# Altium schematic sheet Adapters.SchDoc: various
size 420 x 297 mm; Author: G.Kasprowicz; CompanyName: WUT ISE; DrawnBy: G.Kasprowicz; Organization: WUT ISE; Address1: PW ISE; Address2: Nowowiejska 15/19 00-665 Warsaw; Address3: gkasprow@gmail.com; DocumentNumber: 5; Revision: 2; SheetNumber: 5; SheetTotal: 5; ModifiedBy: -; CheckedDate: -; Title2: adapters; DivGrp: WUT ISE; Designer: G.Kasprowicz; ModifiedDate: -; ProjectName: Sensor Box
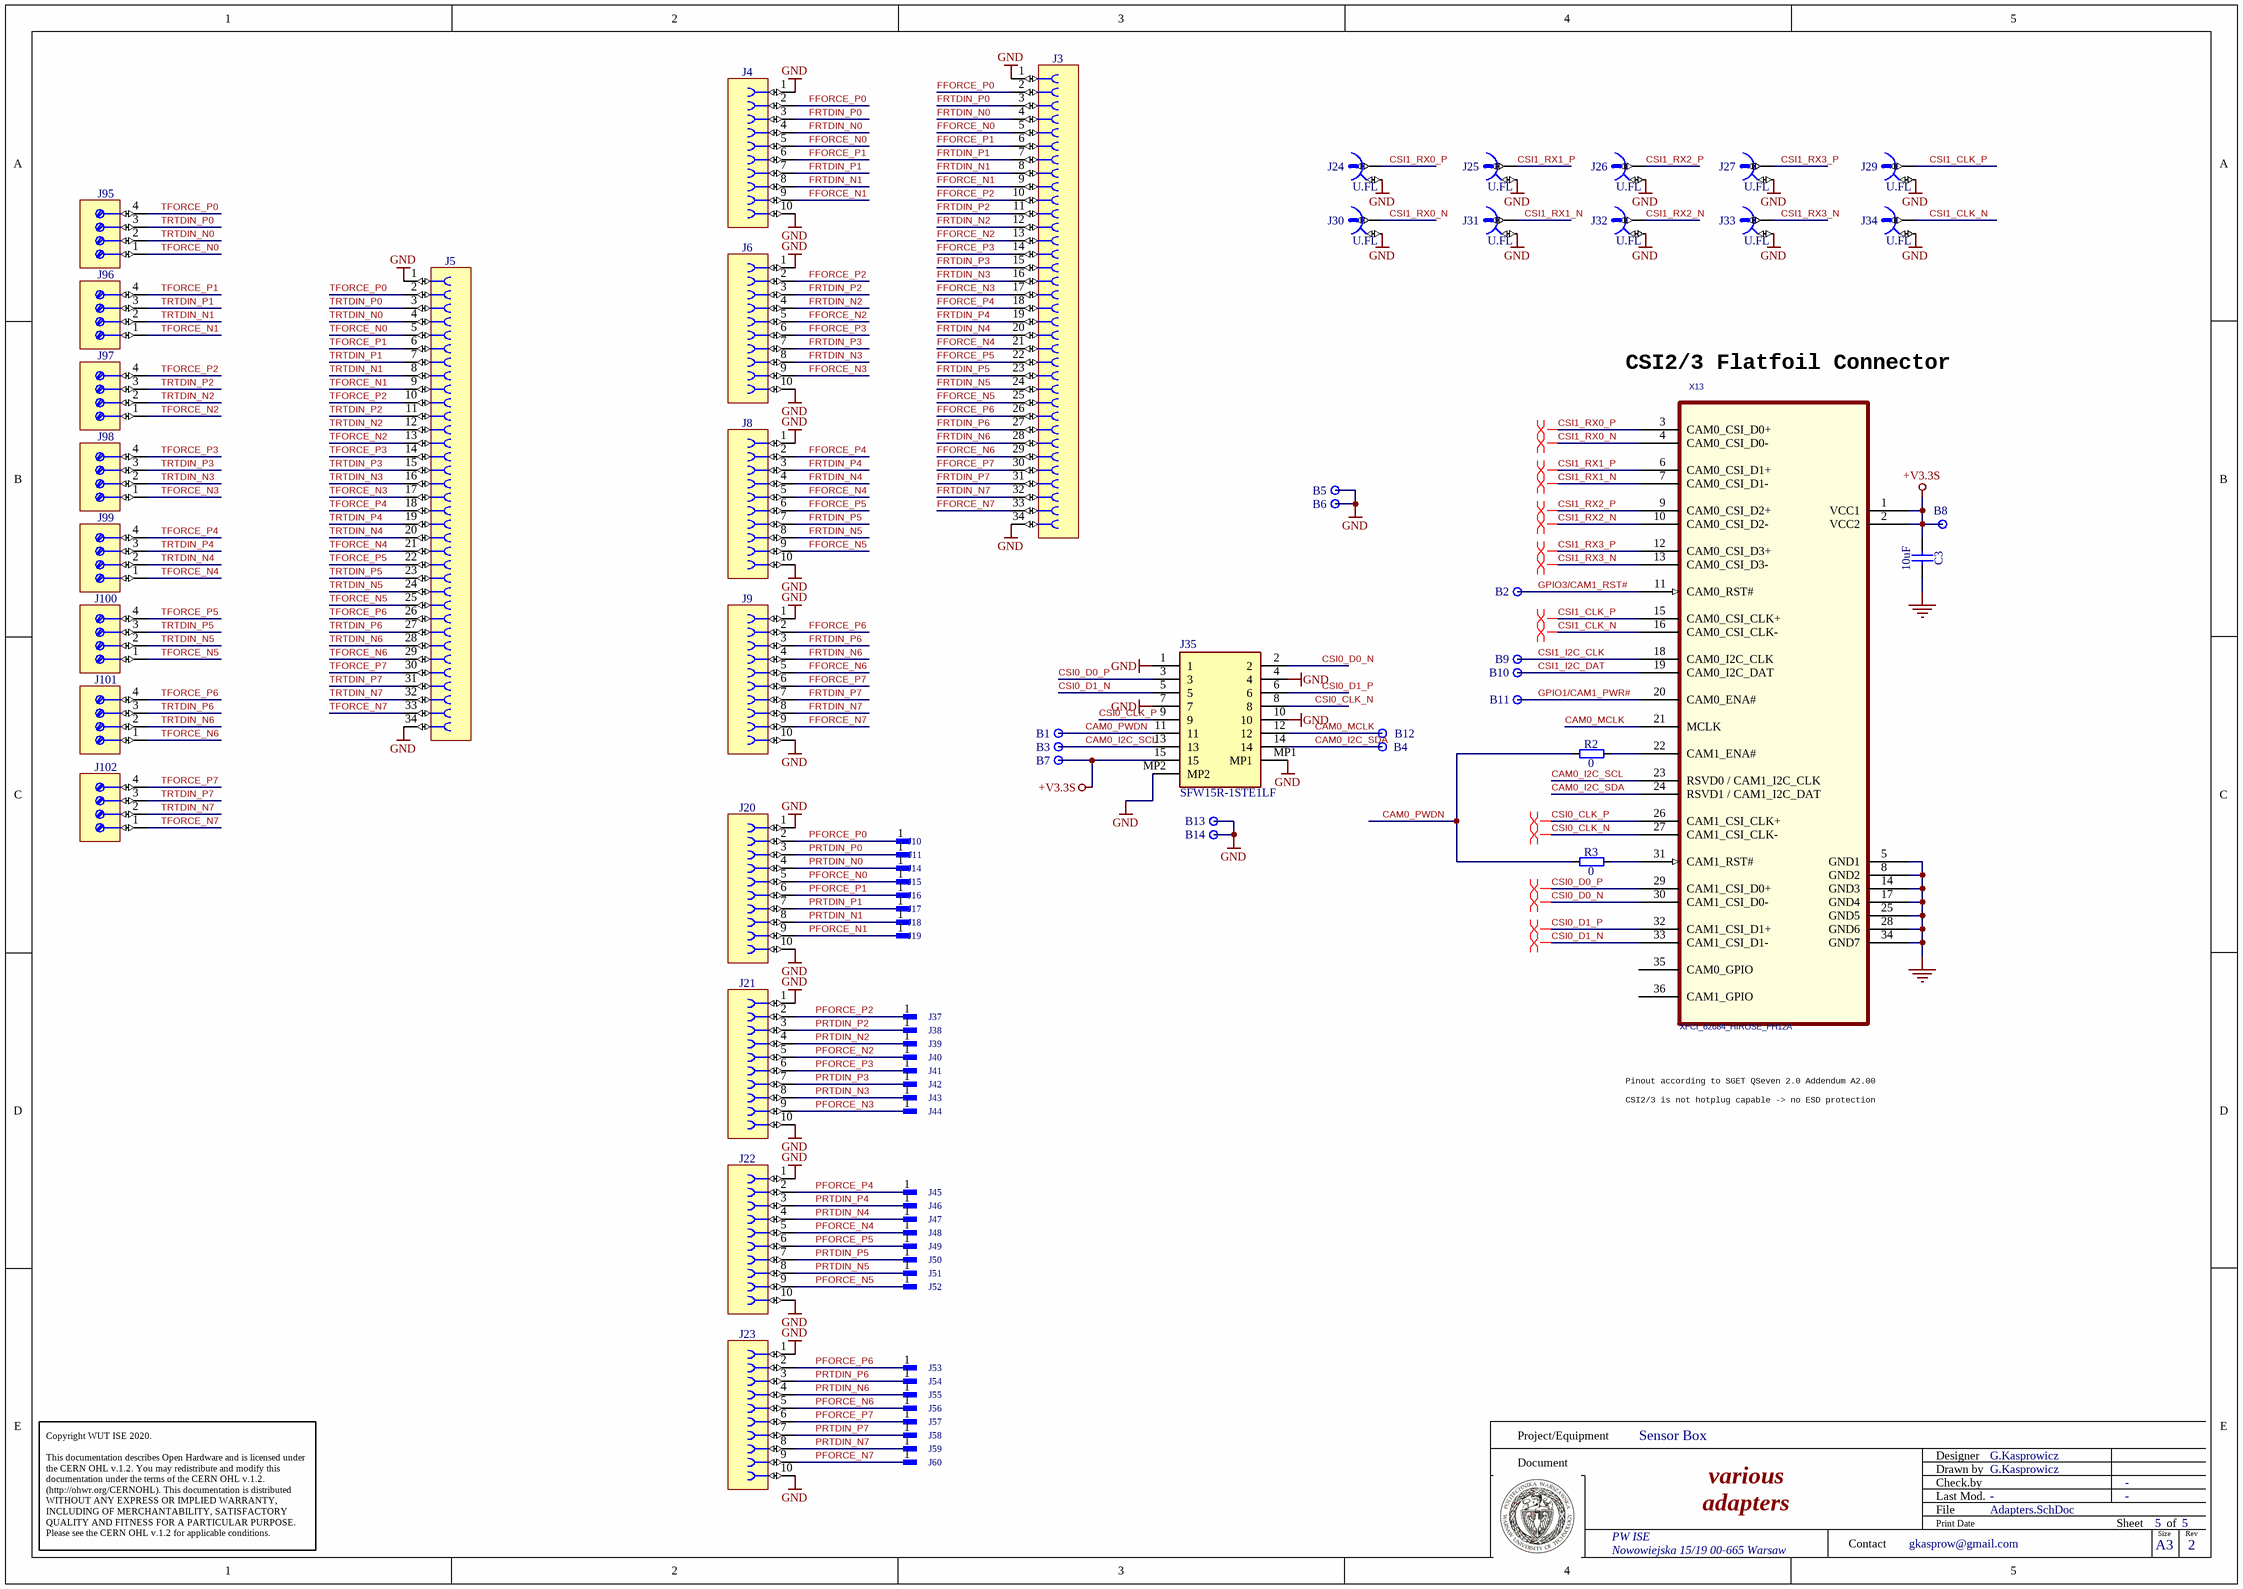
[diagram p0: Adapters.SchDoc]

## Parts
B1  Plated Hole  [c130h80]  (value not drawn)  (no BOM)
B2  Plated Hole  [c130h80]  (value not drawn)  (no BOM)
B3  Plated Hole  [c130h80]  (value not drawn)  (no BOM)
B4  Plated Hole  [c130h80]  (value not drawn)  (no BOM)
B5  Plated Hole  [c130h80]  (value not drawn)  (no BOM)
B6  Plated Hole  [c130h80]  (value not drawn)  (no BOM)
B7  Plated Hole  [c130h80]  (value not drawn)  (no BOM)
B8  Plated Hole  [c130h80]  (value not drawn)  (no BOM)
B9  Plated Hole  [c130h80]  (value not drawn)  (no BOM)
B10  Plated Hole  [c130h80]  (value not drawn)  (no BOM)
B11  Plated Hole  [c130h80]  (value not drawn)  (no BOM)
B12  Plated Hole  [c130h80]  (value not drawn)  (no BOM)
B13  Plated Hole  [c130h80]  (value not drawn)  (no BOM)
B14  Plated Hole  [c130h80]  (value not drawn)  (no BOM)
C3  10uF  [CAPC2012X135N]
J3  Socket 34  [3M_9134-4500PL]  (value not drawn)
J4  FFC/FPC  [MOLEX_52745-1097]  (value not drawn)
J5  Socket 34  [3M_9134-4500PL]  (value not drawn)
J6  FFC/FPC  [MOLEX_52745-1097]  (value not drawn)
J8  FFC/FPC  [MOLEX_52745-1097]  (value not drawn)
J9  FFC/FPC  [MOLEX_52745-1097]  (value not drawn)
J10  SMD Pad  [R350X200]  (value not drawn)
J11  SMD Pad  [R350X200]  (value not drawn)
J14  SMD Pad  [R350X200]  (value not drawn)
J15  SMD Pad  [R350X200]  (value not drawn)
J16  SMD Pad  [R350X200]  (value not drawn)
J17  SMD Pad  [R350X200]  (value not drawn)
J18  SMD Pad  [R350X200]  (value not drawn)
J19  SMD Pad  [R350X200]  (value not drawn)
J20  FFC/FPC  [MOLEX_52745-1097]  (value not drawn)
J21  FFC/FPC  [MOLEX_52745-1097]  (value not drawn)
J22  FFC/FPC  [MOLEX_52745-1097]  (value not drawn)
J23  FFC/FPC  [MOLEX_52745-1097]  (value not drawn)
J24  U.FL  [HIROSE_U.FL-R-SMT-1(10)]
J25  U.FL  [HIROSE_U.FL-R-SMT-1(10)]
J26  U.FL  [HIROSE_U.FL-R-SMT-1(10)]
J27  U.FL  [HIROSE_U.FL-R-SMT-1(10)]
J29  U.FL  [HIROSE_U.FL-R-SMT-1(10)]
J30  U.FL  [HIROSE_U.FL-R-SMT-1(10)]
J31  U.FL  [HIROSE_U.FL-R-SMT-1(10)]
J32  U.FL  [HIROSE_U.FL-R-SMT-1(10)]
J33  U.FL  [HIROSE_U.FL-R-SMT-1(10)]
J34  U.FL  [HIROSE_U.FL-R-SMT-1(10)]
J35  SFW15R-1STE1LF  [SFW15R1STE1LF]
J37  SMD Pad  [R350X200]  (value not drawn)
J38  SMD Pad  [R350X200]  (value not drawn)
J39  SMD Pad  [R350X200]  (value not drawn)
J40  SMD Pad  [R350X200]  (value not drawn)
J41  SMD Pad  [R350X200]  (value not drawn)
J42  SMD Pad  [R350X200]  (value not drawn)
J43  SMD Pad  [R350X200]  (value not drawn)
J44  SMD Pad  [R350X200]  (value not drawn)
J45  SMD Pad  [R350X200]  (value not drawn)
J46  SMD Pad  [R350X200]  (value not drawn)
J47  SMD Pad  [R350X200]  (value not drawn)
J48  SMD Pad  [R350X200]  (value not drawn)
J49  SMD Pad  [R350X200]  (value not drawn)
J50  SMD Pad  [R350X200]  (value not drawn)
J51  SMD Pad  [R350X200]  (value not drawn)
J52  SMD Pad  [R350X200]  (value not drawn)
J53  SMD Pad  [R350X200]  (value not drawn)
J54  SMD Pad  [R350X200]  (value not drawn)
J55  SMD Pad  [R350X200]  (value not drawn)
J56  SMD Pad  [R350X200]  (value not drawn)
J57  SMD Pad  [R350X200]  (value not drawn)
J58  SMD Pad  [R350X200]  (value not drawn)
J59  SMD Pad  [R350X200]  (value not drawn)
J60  SMD Pad  [R350X200]  (value not drawn)
J95  (no value)  [PHOENIX_1725672]
J96  (no value)  [PHOENIX_1725672]
J97  (no value)  [PHOENIX_1725672]
J98  (no value)  [PHOENIX_1725672]
J99  (no value)  [PHOENIX_1725672]
J100  (no value)  [PHOENIX_1725672]
J101  (no value)  [PHOENIX_1725672]
J102  (no value)  [PHOENIX_1725672]
R2  0  [RESC1005X40N]
R3  0  [RESC1005X40N]
X13  XFCI_62684_HIROSE_FH12A  [TYCO_3-1734592-6]

## Nets
+V3.3S: B7.1 B8.1 C3.1 J35.15 X13.1(VCC1) X13.2(VCC2)
GND: B5.1 B6.1 B13.1 B14.1 C3.2 J3.1 J3.34 J4.1 J4.10 J5.1 J5.34 J6.1 J6.10 J8.1 J8.10 J9.1 J9.10 J20.1 J20.10 J21.1 J21.10 J22.1 J22.10 J23.1 J23.10 J24.2 J25.2 J26.2 J27.2 J29.2 J30.2 J31.2 J32.2 J33.2 J34.2 J35.1 J35.4 J35.7 J35.10 J35.MP1 J35.MP2 X13.5(GND1) X13.8(GND2) X13.14(GND3) X13.17(GND4) X13.25(GND5) X13.28(GND6) X13.34(GND7)
CAM0_I2C_SCL: B3.1 J35.13 X13.23(RSVD0_/_CAM1_I2C_CLK)
CAM0_I2C_SDA: B4.1 J35.14 X13.24(RSVD1_/_CAM1_I2C_DAT)
CAM0_MCLK: B12.1 J35.12 X13.21(MCLK)
CAM0_PWDN: B1.1 J35.11 R2.1 R3.1
CSI0_CLK_N: J35.8 X13.27(CAM1_CSI_CLK-)
CSI0_CLK_P: J35.9 X13.26(CAM1_CSI_CLK+)
CSI0_D0_N: J35.2 X13.30(CAM1_CSI_D0-)
CSI0_D0_P: J35.3 X13.29(CAM1_CSI_D0+)
CSI0_D1_N: J35.5 X13.33(CAM1_CSI_D1-)
CSI0_D1_P: J35.6 X13.32(CAM1_CSI_D1+)
CSI1_CLK_N: J34.1 X13.16(CAM0_CSI_CLK-)
CSI1_CLK_P: J29.1 X13.15(CAM0_CSI_CLK+)
CSI1_I2C_CLK: B9.1 X13.18(CAM0_I2C_CLK)
CSI1_I2C_DAT: B10.1 X13.19(CAM0_I2C_DAT)
CSI1_RX0_N: J30.1 X13.4(CAM0_CSI_D0-)
CSI1_RX0_P: J24.1 X13.3(CAM0_CSI_D0+)
CSI1_RX1_N: J31.1 X13.7(CAM0_CSI_D1-)
CSI1_RX1_P: J25.1 X13.6(CAM0_CSI_D1+)
CSI1_RX2_N: J32.1 X13.10(CAM0_CSI_D2-)
CSI1_RX2_P: J26.1 X13.9(CAM0_CSI_D2+)
CSI1_RX3_N: J33.1 X13.13(CAM0_CSI_D3-)
CSI1_RX3_P: J27.1 X13.12(CAM0_CSI_D3+)
FFORCE_N0: J3.5 J4.5
FFORCE_N1: J3.9 J4.9
FFORCE_N2: J3.13 J6.5
FFORCE_N3: J3.17 J6.9
FFORCE_N4: J3.21 J8.5
FFORCE_N5: J3.25 J8.9
FFORCE_N6: J3.29 J9.5
FFORCE_N7: J3.33 J9.9
FFORCE_P0: J3.2 J4.2
FFORCE_P1: J3.6 J4.6
FFORCE_P2: J3.10 J6.2
FFORCE_P3: J3.14 J6.6
FFORCE_P4: J3.18 J8.2
FFORCE_P5: J3.22 J8.6
FFORCE_P6: J3.26 J9.2
FFORCE_P7: J3.30 J9.6
FRTDIN_N0: J3.4 J4.4
FRTDIN_N1: J3.8 J4.8
FRTDIN_N2: J3.12 J6.4
FRTDIN_N3: J3.16 J6.8
FRTDIN_N4: J3.20 J8.4
FRTDIN_N5: J3.24 J8.8
FRTDIN_N6: J3.28 J9.4
FRTDIN_N7: J3.32 J9.8
FRTDIN_P0: J3.3 J4.3
FRTDIN_P1: J3.7 J4.7
FRTDIN_P2: J3.11 J6.3
FRTDIN_P3: J3.15 J6.7
FRTDIN_P4: J3.19 J8.3
FRTDIN_P5: J3.23 J8.7
FRTDIN_P6: J3.27 J9.3
FRTDIN_P7: J3.31 J9.7
GPIO1/CAM1_PWR#: B11.1 X13.20(CAM0_ENA#)
GPIO3/CAM1_RST#: B2.1 X13.11(CAM0_RST#)
PFORCE_N0: J15.1 J20.5
PFORCE_N1: J19.1 J20.9
PFORCE_N2: J21.5 J40.1
PFORCE_N3: J21.9 J44.1
PFORCE_N4: J22.5 J48.1
PFORCE_N5: J22.9 J52.1
PFORCE_N6: J23.5 J56.1
PFORCE_N7: J23.9 J60.1
PFORCE_P0: J10.1 J20.2
PFORCE_P1: J16.1 J20.6
PFORCE_P2: J21.2 J37.1
PFORCE_P3: J21.6 J41.1
PFORCE_P4: J22.2 J45.1
PFORCE_P5: J22.6 J49.1
PFORCE_P6: J23.2 J53.1
PFORCE_P7: J23.6 J57.1
PRTDIN_N0: J14.1 J20.4
PRTDIN_N1: J18.1 J20.8
PRTDIN_N2: J21.4 J39.1
PRTDIN_N3: J21.8 J43.1
PRTDIN_N4: J22.4 J47.1
PRTDIN_N5: J22.8 J51.1
PRTDIN_N6: J23.4 J55.1
PRTDIN_N7: J23.8 J59.1
PRTDIN_P0: J11.1 J20.3
PRTDIN_P1: J17.1 J20.7
PRTDIN_P2: J21.3 J38.1
PRTDIN_P3: J21.7 J42.1
PRTDIN_P4: J22.3 J46.1
PRTDIN_P5: J22.7 J50.1
PRTDIN_P6: J23.3 J54.1
PRTDIN_P7: J23.7 J58.1
TFORCE_N0: J5.5 J95.1
TFORCE_N1: J5.9 J96.1
TFORCE_N2: J5.13 J97.1
TFORCE_N3: J5.17 J98.1
TFORCE_N4: J5.21 J99.1
TFORCE_N5: J5.25 J100.1
TFORCE_N6: J5.29 J101.1
TFORCE_N7: J5.33 J102.1
TFORCE_P0: J5.2 J95.4
TFORCE_P1: J5.6 J96.4
TFORCE_P2: J5.10 J97.4
TFORCE_P3: J5.14 J98.4
TFORCE_P4: J5.18 J99.4
TFORCE_P5: J5.22 J100.4
TFORCE_P6: J5.26 J101.4
TFORCE_P7: J5.30 J102.4
TRTDIN_N0: J5.4 J95.2
TRTDIN_N1: J5.8 J96.2
TRTDIN_N2: J5.12 J97.2
TRTDIN_N3: J5.16 J98.2
TRTDIN_N4: J5.20 J99.2
TRTDIN_N5: J5.24 J100.2
TRTDIN_N6: J5.28 J101.2
TRTDIN_N7: J5.32 J102.2
TRTDIN_P0: J5.3 J95.3
TRTDIN_P1: J5.7 J96.3
TRTDIN_P2: J5.11 J97.3
TRTDIN_P3: J5.15 J98.3
TRTDIN_P4: J5.19 J99.3
TRTDIN_P5: J5.23 J100.3
TRTDIN_P6: J5.27 J101.3
TRTDIN_P7: J5.31 J102.3
NetR2_2: R2.2 X13.22(CAM1_ENA#)
NetR3_2: R3.2 X13.31(CAM1_RST#)

Not connected (* = marked no-connect by the designer): X13 35(CAM0_GPIO) 36(CAM1_GPIO)

## Layout directives
differential pair: CSI0_CLK_N, CSI0_CLK_P, CSI0_D0_N, CSI0_D0_P, CSI0_D1_N, CSI0_D1_P, CSI1_CLK_N, CSI1_CLK_P, CSI1_RX0_N, CSI1_RX0_P, CSI1_RX1_N, CSI1_RX1_P, CSI1_RX2_N, CSI1_RX2_P, CSI1_RX3_N, CSI1_RX3_P

## Notes on the sheet
- CSI2/3 Flatfoil Connector
- Pinout according to SGET QSeven 2.0 Addendum A2.00
  CSI2/3 is not hotplug capable -> no ESD protection
- Project/Equipment
- Document
- Designer
- Drawn by
- Check.by
- Copyright WUT ISE 2020.
  This documentation describes Open Hardware and is licensed under the CERN OHL v.1.2. You may redistribute and modify this documentation under the terms of the CERN OHL v.1.2. (http://ohwr.org/CERNOHL). This documentation is distributed WITHOUT ANY EXPRESS OR IMPLIED WARRANTY, INCLUDING OF MERCHANTABILITY, SATISFACTORY QUALITY AND FITNESS FOR A PARTICULAR PURPOSE. Please see the CERN OHL v.1.2 for applicable conditions.
- Contact
- File
- Last Mod.
- Print Date
- Sheet
- Size
- A3
- of
- Rev

## Library data of the parts
B1-B14 = PLATED_HOLE0.8_PAD1.3: Single Terminal Socket; Part Description: Plated Through Hole: Hole Dia.=0.8mm Pad Dia.=1.3mm, IPC-7251 Level C; Mounted: No; Part Number: PLATED_HOLE0.8_PAD1.3; Component Type: Standard (No BOM); Pin Count: 1; Family: Plated Hole; Socket: No; SMD: No; Sense: No; Status: None; ComponentHeight: 0mm; HelpURL: Undefined; Author: CERN DEM JLC; CreateDate: 30.10.2008; LatestRevisionDate: 30.10.2008; PackageDescription: Plated Through Hole: Hole Dia.=0.8mm Pad Dia.=1.3mm, IPC-7251 Level C
C3 = CC0805_10UF_16V_10%_X5R: Non-polarised capacitor; Part Description: SMD Multilayer Chip Ceramic Capacitor; Manufacturer: GENERIC; Manufacturer1 Part Number: C0805C106K4PAC; Voltage: 16V; TC: X5R; Tolerance: ±10%; Part Number: CC0805_10UF_16V_10%_X5R; Component Kind: Standard; Component Type: Standard; Pin Count: 2; Value: 10uF; Status: Preferred; Manufacturer Part Number: CC0805_10UF_16V_10%_X5R; Case: 0805; Mounted: Yes; Socket: No; SMD: Yes; Manufacturer1 Example: KEMET; Manufacturer1 ComponentHeight: 1.4mm; HelpURL: \\cern.ch\dfs\Applications\Altium\Datasheets\CC1206_X5R_KEMET.pdf; Author: CERN DEM JLC; CreateDate: 03.12.2007; LatestRevisionDate: 03.12.2007; Sense: No
J3 J5 = 3M_9134-4500PL: Connector 34 Female; Part Description: 34 Contacts - Straight .100" x .100" Polarized Boardmount Socket, 9100 Series; Manufacturer: 3M; PressFit: No; Part Number: 3M_9134-4500PL; Component Kind: Standard; Component Type: Standard; Pin Count: 34; Family: Socket 34; Mounted: Yes; Socket: No; SMD: No; Sense: No; Status: None; Manufacturer Part Number: 9134-4500PL; ComponentHeight: 9mm; HelpURL: \\cern.ch\dfs\Applications\Altium\Datasheets\3M_9134-4500PL.pdf; Author: CERN DEM JLC; CreateDate: 11/02/2009; LatestRevisionDate: 11/08/2009
J4 J6 J8 J9 J20-J23 = MOLEX_52745-1097: Connector 10 Female; Part Description: 10 Contacts, 0.5mm Pitch, Right Angled Surface Mount FFC/FPC Connector, ZIF, Top Contact Style; Manufacturer: MOLEX; PressFit: No; Part Number: MOLEX_52745-1097; Component Kind: Standard; Component Type: Standard; Pin Count: 10; Family: FFC/FPC; Mounted: Yes; Socket: No; SMD: Yes; Sense: No; Status: None; Manufacturer Part Number: 52745-1097; ComponentHeight: 2mm; HelpURL: \\cern.ch\dfs\Applications\Altium\Datasheets\MOLEX_52745-1097.pdf; Author: CERN DEM JLC; CreateDate: 04/11/2014; LatestRevisionDate: 05/12/2014
J10 J11 J14-J19 J37-J60 = SMD_PAD_3.5X2MM: Single SMD Pad; Part Description: 3.5mm x 2mm SMD Pad; Mounted: No; Part Number: SMD_PAD_3.5X2MM; Component Kind: Standard (No BOM); Component Type: Standard (No BOM); Pin Count: 1; Family: SMD Pad; Socket: No; SMD: No; Sense: No; Status: None; ComponentHeight: 0mm; HelpURL: Undefined; Author: CERN DEM JLC; CreateDate: 15/03/2010; LatestRevisionDate: 15/03/2010; PackageDescription: 3.5mm x  2mm SMD Pad
J24-J27 J29-J34 = HIROSE_U.FL-R-SMT-1(10): Part Description: Up to 6GHz Ultra Small Surface Mount Male Coaxial Connectors U.FL Series; Manufacturer: HIROSE (HRS); PressFit: No; Part Number: HIROSE_U.FL-R-SMT-1(10); Component Kind: Standard; Component Type: Standard; Pin Count: 2; Family: U.FL; Mounted: Yes; Socket: No; SMD: Yes; Sense: No; Status: None; Manufacturer Part Number: U.FL-R-SMT-1(10); ComponentHeight: 1.25mm; HelpURL: \\cern.ch\dfs\Applications\Altium\Datasheets\HIROSE_U.FL-R-SMT-1(10).pdf; Author: CERN DEM JLC; CreateDate: 24/03/2010; LatestRevisionDate: 24/03/2010
J35 = SFW15R-1STE1LF: Connector; Manufacturer_Name: FCI; Datasheet Link: https://componentsearchengine.com/Datasheets/1/SFW15R-1STE1LF.pdf; Height: 2.7mm; Manufacturer_Part_Number: SFW15R-1STE1LF; Mouser Part Number: 649-SFW15R-1STE1LF; Mouser Price/Stock: https://www.mouser.com/Search/Refine.aspx?Keyword=649-SFW15R-1STE1LF; RS Part Number: 1822728; RS Price/Stock: https://uk.rs-online.com/web/p/products/1822728
J95-J102 = PHOENIX_1725672: Terminal Block, 4 Positions, Screw Connection; Part Description: 6A, 63V, Terminal Block, Pitch 2.54mm, 4 Positions, Screw Connection; Manufacturer: PHOENIX CONTACT; Manufacturer Part Number: 1725672 (MPT 0,5/4-2,54); PressFit: No; Part Number: PHOENIX_1725672; Component Kind: Standard; Component Type: Standard; Pin Count: 4; Mounted: Yes; Socket: No; SMD: No; Sense: No; Status: None; ComponentHeight: 8.5mm; HelpURL: \\cern.ch\dfs\Applications\Altium\Datasheets\PHOENIX_1725672.pdf; Author: CERN DEM JMW; CreateDate: 07.11.2008; LatestRevisionDate: 26.04.2010
R2 R3 = R0402_0R_JUMPER: Resistor; Part Description: 1A (0.05R Max DC Resistance) Zero Ohm Jumper; Manufacturer: GENERIC; Manufacturer1 Part Number: 232270591001L; PressFit: No; Part Number: R0402_0R_JUMPER; Component Kind: Standard; Component Type: Standard; Pin Count: 2; Value: 0; Status: Not Recommended; Manufacturer Part Number: R0402_0R_JUMPER; Case: 0402; Mounted: Yes; Sense: No; Socket: No; SMD: Yes; Manufacturer1 Example: YAGEO PHYCOMP; Manufacturer1 ComponentHeight: 0.4mm; HelpURL: \\cern.ch\dfs\Applications\Altium\Datasheets\R0402_Phycomp_RC0402.pdf; Author: CERN DEM JLC; CreateDate: 03/12/2007; LatestRevisionDate: 17/10/2012
X13 = SGET_CamConn_FCI_Hirose: Part_Number: 41500541; BOM_Level: 1; Revision: A